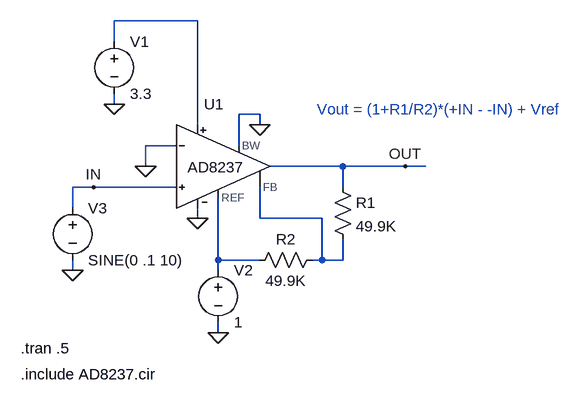
[diagram p0: schematic AD8237_NewSymbolSolution.asc]
AD8237_NewSymbolSolution.asc, the LTspice schematic file:
Version 4
SHEET 1 880 680
WIRE 192 -64 64 -64
WIRE 64 -32 64 -64
WIRE 64 64 64 48
WIRE 288 80 256 80
WIRE 192 96 192 -64
WIRE 288 96 288 80
WIRE 160 128 112 128
WIRE 256 128 256 80
WIRE 112 160 112 128
WIRE 416 160 304 160
WIRE 512 160 416 160
WIRE 544 160 512 160
WIRE 32 192 0 192
WIRE 160 192 32 192
WIRE 416 192 416 160
WIRE 0 224 0 192
WIRE 192 240 192 224
WIRE 288 240 288 192
WIRE 384 240 288 240
WIRE 224 304 224 208
WIRE 288 304 224 304
WIRE 384 304 384 240
WIRE 384 304 368 304
WIRE 416 304 416 272
WIRE 416 304 384 304
WIRE 0 320 0 304
WIRE 224 320 224 304
WIRE 224 416 224 400
FLAG 64 64 0
FLAG 192 240 0
FLAG 288 96 0
FLAG 224 416 0
FLAG 512 160 OUT
FLAG 112 160 0
FLAG 0 320 0
FLAG 32 192 IN
SYMBOL voltage 64 -48 R0
WINDOW 123 0 0 Left 2
WINDOW 39 0 0 Left 2
SYMATTR InstName V1
SYMATTR Value 3.3
SYMBOL voltage 224 304 R0
WINDOW 123 0 0 Left 2
WINDOW 39 0 0 Left 2
SYMATTR InstName V2
SYMATTR Value 1
SYMBOL res 400 176 R0
SYMATTR InstName R1
SYMATTR Value 49.9K
SYMBOL res 384 288 R90
WINDOW 0 0 56 VBottom 2
WINDOW 3 32 56 VTop 2
SYMATTR InstName R2
SYMATTR Value 49.9K
SYMBOL voltage 0 208 R0
WINDOW 123 0 0 Left 2
WINDOW 39 0 0 Left 2
SYMATTR InstName V3
SYMATTR Value SINE(0 .1 10)
SYMBOL AD8237_New\ Symbol 208 112 R0
SYMATTR InstName U1
TEXT -80 440 Left 2 !.tran .5
TEXT -80 480 Left 2 !.include AD8237.cir
TEXT 376 72 Left 2 ;Vout = (1+R1/R2)*(+IN - -IN) + Vref

The netlist it stands for:
* AD8237_NewSymbolSolution.asc
V1 N001 0 3.3
V2 N003 0 1
R1 OUT N002 49.9K
R2 N002 N003 49.9K
V3 IN 0 SINE(0 .1 10)
XU1 0 IN 0 0 N001 N003 N002 OUT AD8237  ; pins BW In+ In- V- V+ REF FB OUT
.tran .5
.include AD8237.cir
* Vout = (1+R1/R2)*(+IN - -IN) + Vref
.backanno
.end